# Altium schematic sheet Shutdown_sch.SchDoc
size 292 x 190 mm; SheetNumber: 1; SheetTotal: 1
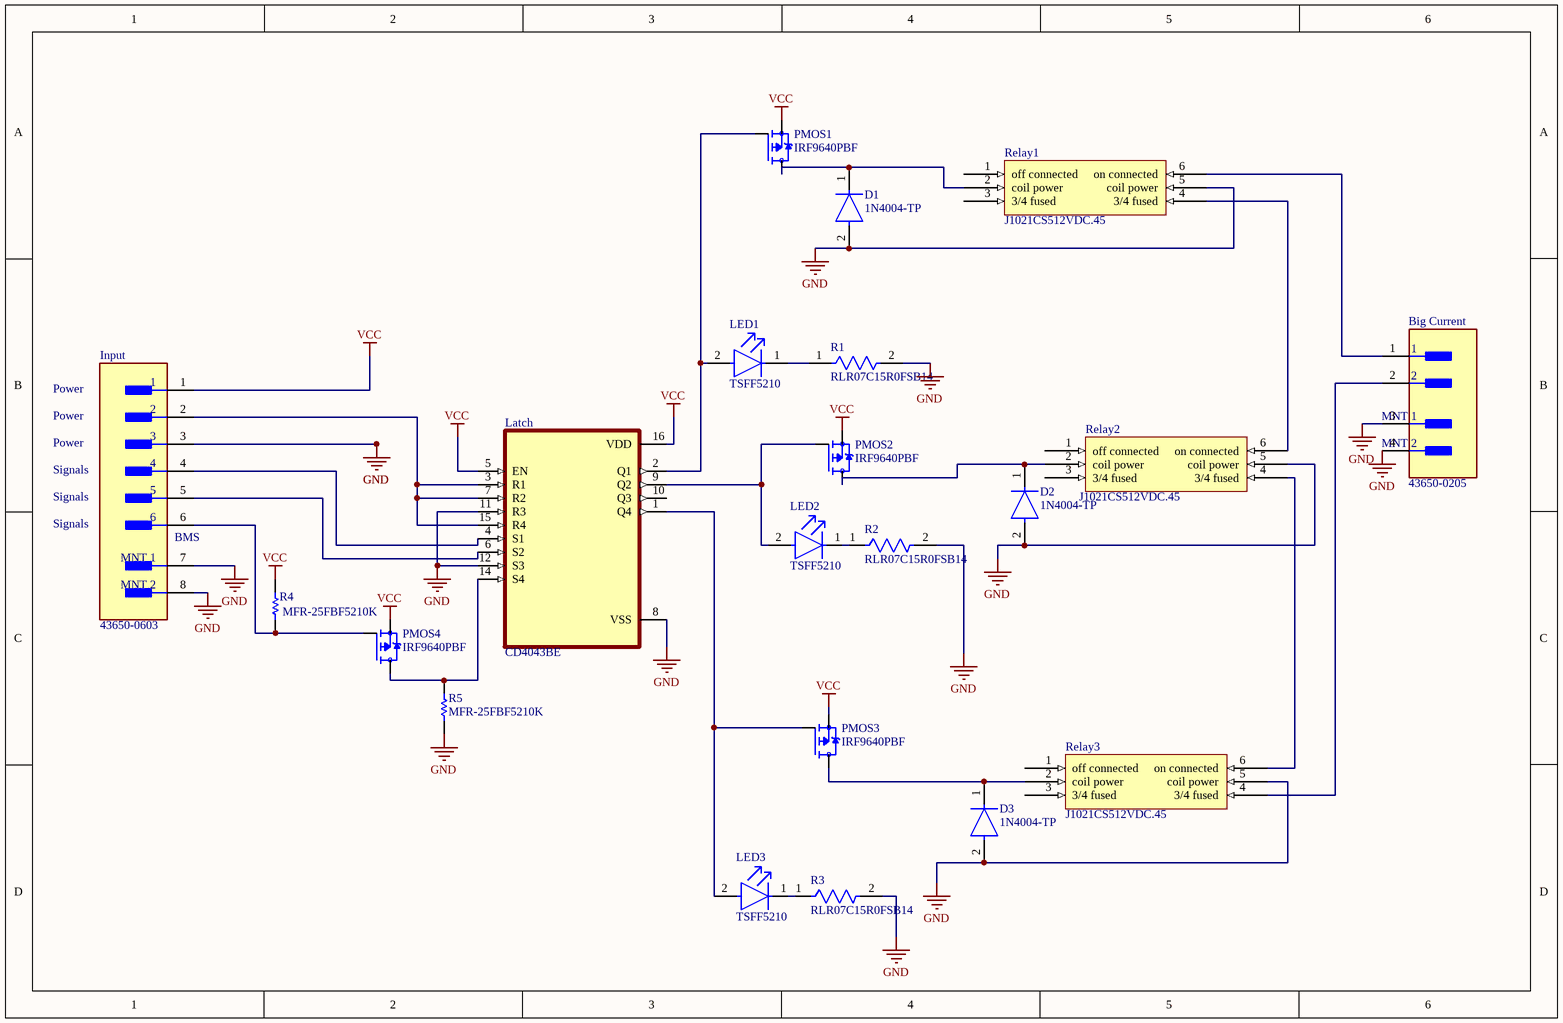
[diagram p0: Shutdown_sch.SchDoc]

## Parts
Big_Current  43650-0205  [FP-43650-0205-MFG]
D1  1N4004-TP  [FP-DO-41-MFG]
D2  1N4004-TP  [FP-DO-41-MFG]
D3  1N4004-TP  [FP-DO-41-MFG]
Input  43650-0603  [FP-43650-0603-MFG]
Latch  CD4043BE  [DIP794W45P254L1969H508Q16]
LED1  TSFF5210  [FP-6_544-5258_09-4-MFG]
LED2  TSFF5210  [FP-6_544-5258_09-4-MFG]
LED3  TSFF5210  [FP-6_544-5258_09-4-MFG]
PMOS1  IRF9640PBF  [TO254P1052X465X1989-3]
PMOS2  IRF9640PBF  [TO254P1052X465X1989-3]
PMOS3  IRF9640PBF  [TO254P1052X465X1989-3]
PMOS4  IRF9640PBF  [TO254P1052X465X1989-3]
R1  RLR07C15R0FSB14  [FP-RLR07-MFG]
R2  RLR07C15R0FSB14  [FP-RLR07-MFG]
R3  RLR07C15R0FSB14  [FP-RLR07-MFG]
R4  MFR-25FBF5210K  [RESA60-630X240]
R5  MFR-25FBF5210K  [RESA60-630X240]
Relay1  J1021CS512VDC.45  [J1021CS512VDC.45-Footprint-2]
Relay2  J1021CS512VDC.45  [J1021CS512VDC.45-Footprint-2]
Relay3  J1021CS512VDC.45  [J1021CS512VDC.45-Footprint-2]

## Nets
GND: Big_Current.3(MNT_1) Big_Current.4(MNT_2) D1.2(A) D2.2(A) D3.2(A) Input.3 Input.7(MNT_1) Input.8(MNT_2) Latch.8(VSS) Latch.11(R3) Latch.12(S3) R1.2 R2.2 R3.2 R5.1 Relay1.5(coil_power) Relay2.5(coil_power) Relay3.5(coil_power)
VCC: Input.1 Latch.5(EN) Latch.16(VDD) PMOS1.3(S) PMOS2.3(S) PMOS3.3(S) PMOS4.3(S) R4.2
NetBig_Current_1: Big_Current.1 Relay1.6(on_connected)
NetBig_Current_2: Big_Current.2 Relay3.4(3/4_fused)
NetD1_1: D1.1(C) PMOS1.2(D) Relay1.2(coil_power)
NetD2_1: D2.1(C) PMOS2.2(D) Relay2.2(coil_power)
NetD3_1: D3.1(C) PMOS3.2(D) Relay3.2(coil_power)
NetInput_2: Input.2 Latch.3(R1) Latch.7(R2) Latch.15(R4)
NetInput_4: Input.4 Latch.4(S1)
NetInput_5: Input.5 Latch.6(S2)
NetInput_6: Input.6 PMOS4.1(G) R4.1
NetLatch_1: Latch.1(Q4) LED3.2(A) PMOS3.1(G)
NetLatch_2: Latch.2(Q1) LED1.2(A) PMOS1.1(G)
NetLatch_9: Latch.9(Q2) LED2.2(A) PMOS2.1(G)
NetLatch_14: Latch.14(S4) PMOS4.2(D) R5.2
NetLED1_1: LED1.1(C) R1.1
NetLED2_1: LED2.1(C) R2.1
NetLED3_1: LED3.1(C) R3.1
NetRelay1_4: Relay1.4(3/4_fused) Relay2.6(on_connected)
NetRelay2_4: Relay2.4(3/4_fused) Relay3.6(on_connected)

Not connected (* = marked no-connect by the designer): Latch 10(Q3); Relay1 1(off_connected) 3(3/4_fused); Relay2 1(off_connected) 3(3/4_fused); Relay3 1(off_connected) 3(3/4_fused)

## Notes on the sheet
- Power
- Signals
- (near Input) BMS

## Library data of the parts
Big_Current = CMP-00257-07672643-1: 43650-0205 Conn Wire to Board HDR 2 POS 3mm Solder RA Side Entry Thru-Hole Micro-Fit 3.0™ Tray; Manufacturer Lifecycle Status: ACTIVE; Plating: Tin; Glow Wire Compliant: Compliant; Number of Contacts: 2; Gender: Male; Voltage Rating: 600V; Current Rating: 5A; Lifecycle Status: Production; RoHS: Compliant; Number of Rows: 1; Housing Material: Thermoplastic; Country of Origin: US; Number of Circuits: 2; Halogen Free: Low Halogen; Orientation: Right Angle; Termination: Through Hole; Pitch: 3mm; Contact Material: Brass; Contact Plating: Gold; NexarPartId: 7672643; Number of Positions: 2
D1-D3 = CMP-56207-000012-1: DIODE GEN PURP 400V 1A DO41; Forward Voltage: 1V; Recovery Time: 2000ns; Capacitance: 15pF; Element Configuration: Single; Peak Non-Repetitive Surge Current: 30A; Reverse Recovery Time: 2us; Polarity: Standard; Max Reverse Current: 5uA; Max Reverse Voltage (DC): 400V; Min Operating Temperature: -55°C; Packaging: Tape and Reel; Reverse Voltage: 400V; RoHS Compliant: Yes; Case/Package: DO-41; Package Quantity: 1; Max Operating Temperature: 150°C; Mount: Through Hole; Forward Current: 1A; Current Rating: 1A; Voltage Rating (DC): 400V; Diameter: 2.7mm; Length: 5.2mm; Lead Free: Lead Free; Number of Pins: 2; Output Current: 1A; Max Repetitive Reverse Voltage (Vrrm): 400V; Radiation Hardening: No; Max Surge Current: 30A; Max Forward Surge Current (Ifsm): 30A; Average Rectified Current: 1A
Input = CMP-00257-00298086-1: 43650-0603 Conn Power HDR 6 POS 3mm Solder RA Thru-Hole 6 Terminal 1 Port Micro-Fit 3.0™ Frame; NexarPartId: 298086; Manufacturer Lifecycle Status: ACTIVE; Gender: Male; Connector Type: Male Pin; Voltage Rating: 600V; Voltage Rating (DC): 250V; Number of Circuits: 6; Glow Wire Compliant: Compliant; Plating: Tin; Current Rating: 5A; Contact Plating: Tin; Housing Color: Black; Halogen Free: Low Halogen; Country of Origin: US; Fastening Type: Ramp; Housing Material: Thermoplastic; Mount: Through Hole; Color: Black; Pitch: 3mm; Termination: Solder; Contact Gender: Male; Lifecycle Status: Production; Number of Positions: 6; Contact Material: Brass; Orientation: Right Angle; RoHS: Compliant; Number of Contacts: 6; Min Operating Temperature: -40°C; Flammability Rating: UL94 V-0; Number of Rows: 1; Max Operating Temperature: 105°C; Lead Pitch: 3mm
Latch = CD4043BE: CMOS Quad NOR R/S Latch with 3-State Outputs 16-PDIP -55 to 125; MF: Texas Instruments; Value: *; Arrow_Electronics-Purchase-URL: https://snapeda.com/shop?store=Arrow+Electronics&id=577167; Package: PDIP-16 Texas Instruments; DigiKey-Purchase-URL: https://snapeda.com/shop?store=DigiKey&id=577167; Mouser-Purchase-URL: https://snapeda.com/shop?store=Mouser&id=577167; Price: None; MP: CD4043BE; Availability: Good; SnapEDA_Link: https://www.snapeda.com/parts/CD4043BE/Texas%20Instruments/view-part/577167/?ref=snap; Texas_Instruments-Purchase-URL: https://snapeda.com/shop?store=Texas+Instruments&id=577167; BuyPart: https://www.snapeda.com/parts/CD4043BE/Texas%20Instruments/view-part/577167/?ref=eda
LED1-LED3 = CMP-00030-41223146-1: TSFF5210 TSFF5210 IR LED, 870nm, T-1 3/4 (5mm) Through Hole package; Number of Elements: 1; Power Dissipation: 180W; Viewing Angle: 20°; Power Rating: 250mW; Test Current: 100mA; Forward Voltage: 1.5V; Lens Style: Circular, Colorless, Diffused, Round; Rise Time: 15ns; Reverse Voltage: 5V; REACH SVHC: Unknown; Packaging: Bulk; Schedule B: 8541402000, 8541402000; Number of LEDs: 1; Mount: Through Hole; Depth: 5.8mm; Max Operating Temperature: 85°C; Radiation Hardening: No; Case/Package: Radial; NexarPartId: 41223146; Lead Free: Lead Free; Number of Pins: 2; Wavelength: 870nm; RoHS: Compliant; Orientation: Top View; Length: 5.8mm; Peak Wavelength: 870nm; Contact Plating: Tin; Min Operating Temperature: -40°C; Forward Current: 100mA
PMOS1-PMOS4 = IRF9640PBF: P-Channel 200V 11A (Tc) 125W (Tc) Through Hole TO-220AB; MF: Vishay Siliconix; SnapEDA_Link: https://www.snapeda.com/parts/IRF9640PBF/Vishay%20Siliconix/view-part/238294/?ref=snap; Purchase-URL: https://pricing.snapeda.com/search/part/IRF9640PBF/?ref=eda; Value: *; Check_prices: https://www.snapeda.com/parts/IRF9640PBF/Vishay%20Siliconix/view-part/238294/?ref=eda; Availability: Good; Price: None; MP: IRF9640PBF; Package: TO-220 Vishay
R1-R3 = CMP-00030-42769933-1: RLR07C15R0FSB14 Res Metal Film 15 Ohm 1% 1/4W ±100ppm/°C 0.001% Conformal AXL Thru-Hole Bulk; Power Rating: 250mW; Resistance: 15Ω; Failure Rate: 0.001%; Contact Plating: Lead, Tin; Case/Package: Conformal; Width: 2.29mm; Min Operating Temperature: -65°C; Number of Terminations: 2; Features: Military, Moisture Resistant, Weldable; Military Standard: MIL-PRF-39017; Length: 7.62mm; NexarPartId: 42769933; Temperature Coefficient: 100ppm/°C; Mount: Through Hole; Tolerance: 1%; Diameter: 2.29mm; Max Operating Temperature: 150°C; Packaging: Bulk; Schedule B: 8533210090; Max Power Dissipation: 250mW; Lead Free: Contains Lead; Termination: Axial; RoHS: Compliant; Composition: Metal Film
R4 R5 = CMP-1659-00074-2: Axial Resistor, 10 KOhm, +/- 1%, 0.25 W, -55 to 155 degC, 2-Pin THD, RoHS, Bulk; Manufacturer: Yageo; Temperature Coefficient: 100ppm\/degreesC; Voltage Rating: 250V; Voltage Rating (DC): 200V; Resistance: 10KOhm; Max Power Dissipation: 250mW; Datasheet URL: http://www.yageo.com/documents/recent/Yageo%20LR_MFR_2013.pdf; Packaging: Bulk; RoHSCompliant: True; Mount: ThroughHole; Package Reference: MFR-25; Termination: Axial; Composition: MetalFilm; Number of Terminations: 2; Package Quantity: 200; Mounting Technology: ThroughHole; Length: 0.248inch; Max Operating Temperature: 155degC; Min Operating Temperature: -55degC; Datasheet Version: 04/2013; Lead Free: LeadFree; Manufacturer URL: http://www.yageo.com/; Tolerance: 1%; Power Rating: 250mW; Package Description: 2-Pin Axial Lead, Dia 2.4 mm, Body Length 6.3 mm; Military Standard: Not; Case\/Package: Axial
Relay1-Relay3 = CMP-008-00005-1: Current Rating: 5A; Mounting Technology: TH; Pins: 6